# EAGLE design router (EAGLE 8.3.2)
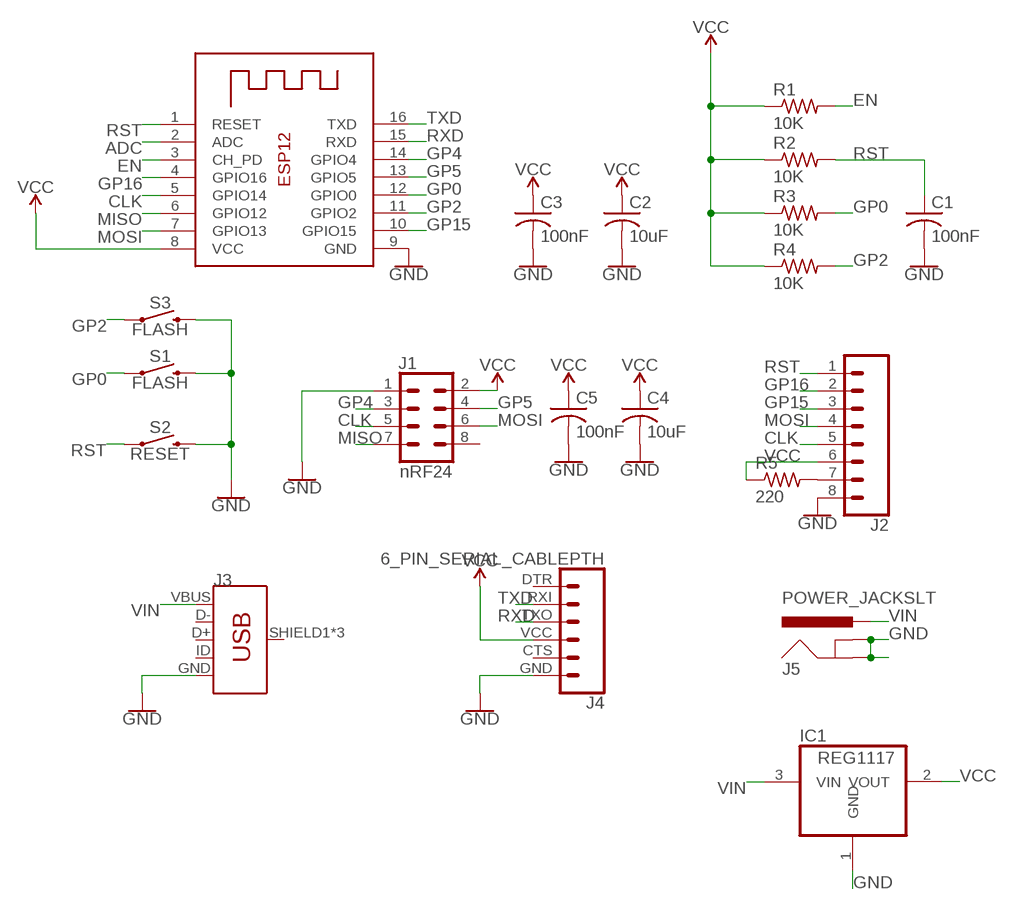
[diagram p0: schematic, sheet 1]

## Parts
C1  100nF  C-USC1206  [C1206]
C2  10uF  C-USC1206  [C1206]
C3  100nF  C-USC1206  [C1206]
C4  10uF  C-USC1206  [C1206]
C5  100nF  C-USC1206  [C1206]
IC1  REG1117  [SOT223]
J1  nRF24  CONN_04X2  [2X4]
J2  CONN_08"  [1X08]
J3  USB_MICRO-B_FEMALE-SMT  [USB-B-MICRO-SMD]
J4  6_PIN_SERIAL_CABLEPTH  [FTDI_BASIC]
J5  POWER_JACKSLT  [POWER_JACK_SLOT]
R1  10K  R-US_M1206  [M1206]
R2  10K  R-US_M1206  [M1206]
R3  10K  R-US_M1206  [M1206]
R4  10K  R-US_M1206  [M1206]
R5  220  R-US_M1206  [M1206]
S1  FLASH  MOMENTARY-SWITCH-SPST-PTH-6.0MM  [TACTILE_SWITCH_PTH_6.0MM]
S2  RESET  MOMENTARY-SWITCH-SPST-PTH-6.0MM  [TACTILE_SWITCH_PTH_6.0MM]
S3  FLASH  MOMENTARY-SWITCH-SPST-PTH-6.0MM  [TACTILE_SWITCH_PTH_6.0MM]
X1  ESP-12  [ESP-12]

## Nets
ADC: X1.2(ADC)
CLK: J1.5 J2.5 X1.5(GPIO14)
EN: R1.2 X1.3(CH_PD)
GND: C1.2 C2.2 C3.2 C4.2 C5.2 IC1.1(GND) J1.1 J2.8 J3.GND J4.GND J5.GND@1(GNDBREAK) J5.GND@2(GND) S1.3 S2.3 S3.3 X1.9(GND)
GP0: R3.2 S1.1 X1.12(GPIO0)
GP2: R4.2 S3.1 X1.11(GPIO2)
GP4: J1.3 X1.14(GPIO4)
GP5: J1.4 X1.13(GPIO5)
GP15: J2.3 X1.10(GPIO15)
GP16: J2.2 X1.4(GPIO16)
MISO: J1.7 X1.6(GPIO12)
MOSI: J1.6 J2.4 X1.7(GPIO13)
N$1: R5.1
N$14: J2.7 R5.2
RST: C1.1 J2.1 R2.2 S2.1 X1.1(RESET)
RXD: J4.TXO X1.15(RXD)
TXD: J4.RXI X1.16(TXD)
VCC: C2.1 C3.1 C4.1 C5.1 IC1.2(VOUT) J1.2 J2.6 J4.VCC R1.1 R2.1 R3.1 R4.1 X1.8(VCC)
VIN: IC1.3(VIN) J3.VBUS J5.PWR
Unconnected: J1.8 J3.D+ J3.D- J3.ID J3.SHIELD1(SHIELD) J3.SHIELD2(SHIELD) J3.SHIELD3(SHIELD) J4.CTS J4.DTR

## Library data of the parts
C1-C5 = adafruit:C-US: CAPACITOR, American symbol
IC1 = burr-brown:REG1117: 800mA and 1A Low Dropout (LDO) Positive Regulator 1.8V, 2.5V, 2.85V, 3.3V, 5V, and Adj; MPN: REG1117; OC_FARNELL: 1097566; OC_NEWARK: 14P6981
J1 = SparkFun-Connectors:CONN_04X2: Multi connection point. Often used as Generic Header-pin footprint for 0.1 inch spaced/style header connections On any of the 0.1 inch spaced packages, you can populate with these: Break Away Headers - Straight <https://www.sparkfun.com/products/116> (PRT-00116) Break Away Male Headers - Right Angle <https://www.sparkfun.com/products/553> (PRT-00553) Female Headers <https://www.sparkfun.com/products/115> (PRT-00115) Break Away Headers - Machine Pin <https://www.sparkfun.com/products/117> (PRT-00117) Break Away Female Headers - Swiss Machine Pin <https://www.sparkfun.com/products/743> (PRT-00743)
J2 = SparkFun-Connectors:CONN_08: Multi connection point. Often used as Generic Header-pin footprint for 0.1 inch spaced/style header connections On any of the 0.1 inch spaced packages, you can populate with these: Break Away Headers - Straight <https://www.sparkfun.com/products/116> (PRT-00116) Break Away Male Headers - Right Angle <https://www.sparkfun.com/products/553> (PRT-00553) Female Headers <https://www.sparkfun.com/products/115> (PRT-00115) Break Away Headers - Machine Pin <https://www.sparkfun.com/products/117> (PRT-00117) Break Away Female Headers - Swiss Machine Pin <https://www.sparkfun.com/products/743> (PRT-00743) Arduino Stackable Header - 8 Pin <https://www.sparkfun.com/products/9279> (PRT-09279) For SCREWTERMINALS and SPRING TERMINALS visit here: Screw Terimnals on SparkFun.com <https://www.sparkfun.com/search/results?term=Screw+Terminals> (5mm/3.5mm/2.54mm spacing) This device is also useful as a general connection point to wire up your design to another part of your project. Our various solder wires solder well into these plated through hole pads. Hook-Up Wire - Assortment (Stranded, 22 AWG) <https://www.sparkfun.com/products/11375> (PRT-11375) Hook-Up Wire - Assortment (Solid Core, 22 AWG) <https://www.sparkfun.com/products/11367> (PRT-11367) View the entire wire category on our website here <https://www.sparkfun.com/categories/141> Special notes: Molex polarized connector foot print use with SKU : PRT-08231 with associated crimp pins and housings. 1MM SMD Version SKU: PRT-10208 NOTES ON THE VARIANTS LOCK and LOCK_LONGPADS... This footprint was designed to help hold the alignment of a through-hole component (i.e. 6-pin header) while soldering it into place. You may notice that each hole has been shifted either up or down by 0.005 of an inch from it's more standard position (which is a perfectly straight line). This slight alteration caused the pins (the squares in the middle) to touch the edges of the holes. Because they are alternating, it causes a "brace" to hold the component in place. 0.005 has proven to be the perfect amount of "off-center" position when using our standard breakaway headers. Although looks a little odd when you look at the bare footprint, once you have a header in there, the alteration is very hard to notice. Also,if you push a header all the way into place, it is covered up entirely on the bottom side.; PROD_ID: CONN-08438
J3 = SparkFun-Connectors:USB_MICRO-B: USB Type Micro-B Connector Male/female and PTH/SMT variants SparkFun Products: SparkFun microB USB Breakout <https://www.sparkfun.com/products/12035> SparkFun USB microB Plug Breakout <https://www.sparkfun.com/products/10031> SparkFun ESP8266 Thing <https://www.sparkfun.com/products/13231>; PROD_ID: CONN-11752
J4 = SparkFun-Connectors:6_PIN_SERIAL_CABLE: 6-pin header connection for use with the "FTDI BASIC" pinout - CABLE SIDE. Also known as "Arduino Serial Program Header". This is used on a design to provide a 6-pin connection point for serial communication usually from a USB cable (D+/D-) to these headers (RX/TX). It also has the remaining pins necessary for programming in the Arduino evironment (DTR, GND, and sometimes VCC). Note, this device has "CABLE" in the name. It is intended to be used on a design that usually lives on the end of your USB cable and prvides the converter chip (FTDI232 or FTDI231x) to commnicate serial RX/TX. The "sister" device, named "TARGET" is inteneded to be used on a design that contains a target micro-controller that you wish to program. You can populate with some of these: Female Headers <https://www.sparkfun.com/products/115> (PRT-00115) For reference (or to suit your programming needs) check out these designs: SparkFun FTDI Basic Breakout - 5V <https://www.sparkfun.com/products/9716> (DEV-09716) SparkFun FTDI Basic Breakout - 3.3V <https://www.sparkfun.com/products/9873> (DEV-09873) SparkFun FTDI SmartBasic <https://www.sparkfun.com/products/12935> (DEV-12935) SparkFun Beefy 3 - FTDI Basic Breakout <https://www.sparkfun.com/products/13746> (DEV-13746)
J5 = SparkFun-Connectors:POWER_JACK: Power Jack Connector This is the standard 5.5mm barrel jack for power. The PTH is the most common, proven, reliable, footprint. The Slot footprint only works if the mill layer is transmitted to the PCB fab house so be warned. Here are the connectors we sell at SparkFun: DC Barrel Power Jack/Connector <https://www.sparkfun.com/products/119> (PRT-00119) DC Barrel Power Jack/Connector (SMD) <https://www.sparkfun.com/products/12748> (PRT-12748) DC Barrel Jack Adapter - Breadboard Compatible <https://www.sparkfun.com/products/10811> (PRT-10811) It is used on this SparkFun product (and many, many others): SparkFun RedBoard - Programmed with Arduino <https://www.sparkfun.com/products/12757> (DEV-12757) Also, if you need a mating power supply or connector, please check these out: Wall Adapter Power Supply - 9VDC 650mA <https://www.sparkfun.com/products/298> (TOL-00298) DC Barrel Jack Adapter - Male <https://www.sparkfun.com/products/10287> (PRT-10287); PROD_ID: PRT-00119
R1-R5 = resistor:R-US_: RESISTOR, American symbol
S1-S3 = SparkFun-Switches:MOMENTARY-SWITCH-SPST: Momentary Switch (Pushbutton) - SPST Normally-open (NO) SPST momentary switches (buttons, pushbuttons). Variants PTH-12MM - 12mm square, through-hole Momentary Pushbutton Switch - 12mm Square <https://www.sparkfun.com/products/9190> (COM-09190) PTH-6.0MM, PTH-6.0MM-KIT - 6.0mm square, through-hole Mini Pushbutton Switch <https://www.sparkfun.com/products/97> (COM-00097) KIT package intended for soldering kit's - only one side of pads' copper is exposed. PTH-RIGHT-ANGLE-KIT - Right-angle, through-hole Right Angle Tactile Button <https://www.sparkfun.com/products/10791> - Used on SparkFun BigTime Watch Kit <https://www.sparkfun.com/products/11734> SMD-12MM - 12mm square, surface-mount Tactile Button - SMD (12mm) <https://www.sparkfun.com/products/12993> (COM-12993) Used on SparkFun PicoBoard <https://www.sparkfun.com/products/11888> SMD-4.5MM - 4.5mm Square Trackball Switch Used on SparkFun Blackberry Trackballer Breakout <https://www.sparkfun.com/products/13169> SMD-4.6MMX2.8MM - 4.60mm x 2.80mm, surface mount Used on SparkFun SAMD21 Mini Breakout <https://www.sparkfun.com/products/13664> SMD-5.2MM, SMD-5.2-REDUNDANT - 5.2mm square, surface-mount Mini Pushbutton Switch - SMD <https://www.sparkfun.com/products/8720> (COM-08720) Used on Arduino Pro Mini <https://www.sparkfun.com/products/11114> REDUNDANT package connects both switch circuits together SMD-6.0X3.5MM - 6.0 x 3.5mm, surface mount Momentary Reset Switch SMD <https://www.sparkfun.com/products/8229> (COM-08229) SMD-6.2MM-TALL - 6.2mm square, surface mount Tactile Button - SMD (6mm) <https://www.sparkfun.com/products/12992> Used on SparkFun Digital Sandbox <https://www.sparkfun.com/products/12651> SMD-RIGHT-ANGLE - Right-angle, surface mount Used on SparkFun Block for Intel® Edison - Arduino <https://www.sparkfun.com/products/13036>; PROD_ID: SWCH-08441; SF_SKU: COM-00097
X1 = adafruit:ESP-12

## Board
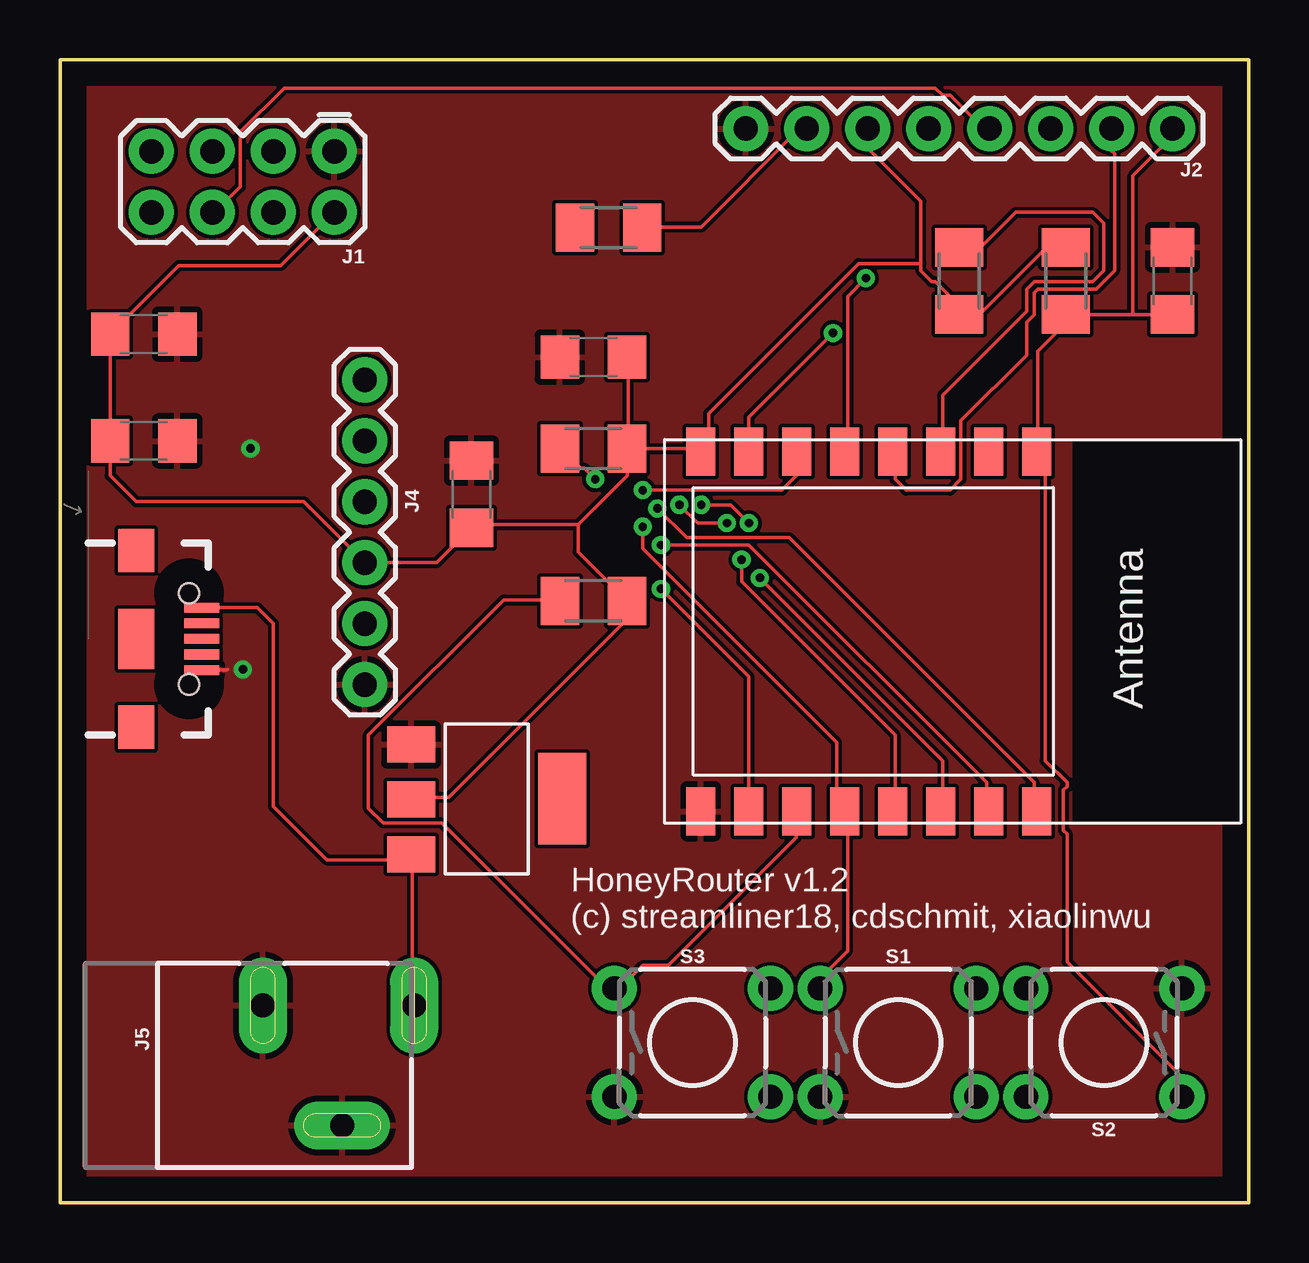
[diagram p1: board, top side]
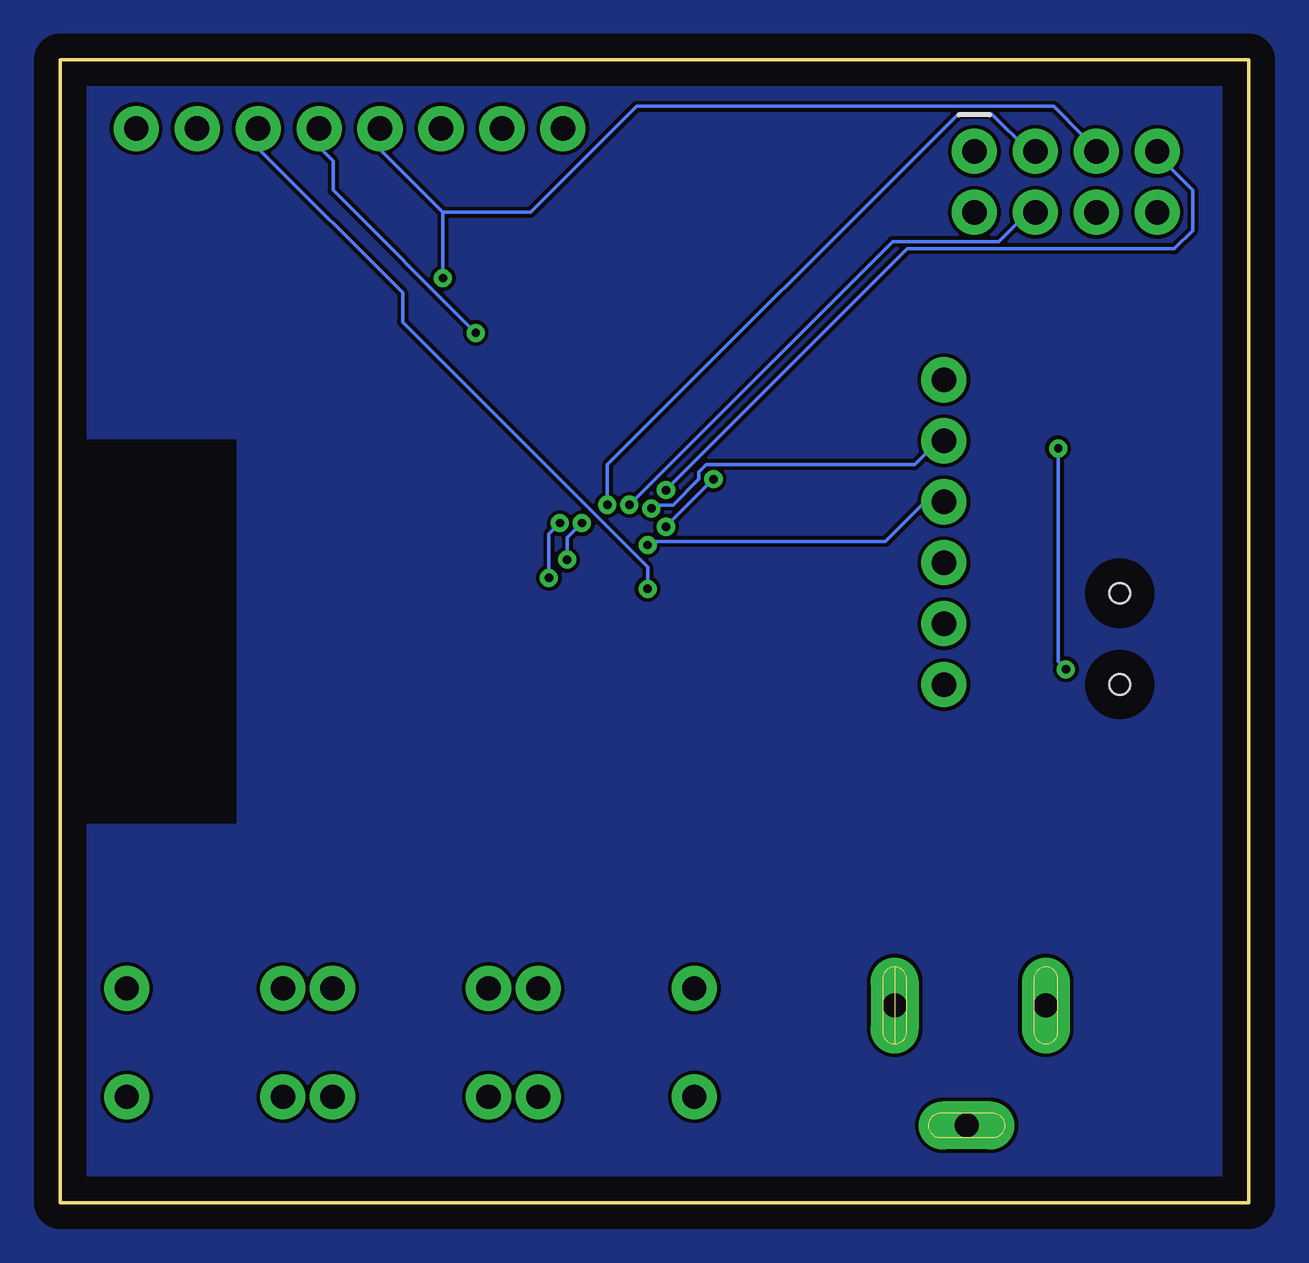
[diagram p2: board, bottom side, seen from below]

Size 49.53 x 47.62 mm. Coordinates in mm from the lower left corner, seen from the top.
Outline: 0,47.62 0,0 49.53,0 49.53,47.62 0,47.62
Copper layers (1*16): Top 0.035mm / dielectric 1.5mm / Bottom 0.035mm
Design rules "default": minimum track width 6mil, minimum drill 0.35mm, track to track 6mil, track to pad 6mil, pad to pad 6mil, via to via 6mil, smd to smd 6mil, copper to edge 40mil, drill to drill 6mil, minimum pad ring 10mil, minimum via ring 8mil, stop-mask expansion 4mil, vias tented up to drill 0mil, thermal gap 10mil

### Footprints (pad centres in the part's own frame; a part is rotated, then mirrored left to right if it is on the bottom)
C1206 = smd 1.6 x 1.8: 1 -1.4,0; 2 1.4,0
SOT223 = smd 1.499 x 2.007: 1 -2.261,-3.15; 2 0.025,-3.15; 3 2.311,-3.15 | smd 3.81 x 2.007: 4 0,3.15
2X4 = drill 1.016 pad 1.88: 1 -3.81,-1.27; 2 -3.81,1.27; 3 -1.27,-1.27; 4 -1.27,1.27; 5 1.27,-1.27; 6 1.27,1.27; 7 3.81,-1.27; 8 3.81,1.27
1X08 = drill 1.016 pad 1.88: 1 0,0; 2 2.54,0; 3 5.08,0; 4 7.62,0; 5 10.16,0; 6 12.7,0; 7 15.24,0; 8 17.78,0
USB-B-MICRO-SMD = smd 1.45 x 0.4: D+ 2.725,0; D- 2.725,0.65; GND 2.725,-1.3; ID 2.725,-0.65; VBUS 2.725,1.3 | smd 1.5 x 1.8: SHIELD1 0,3.685; SHIELD2 0,-3.685 | smd 1.5 x 2.5: SHIELD3 0,0 | hole 0.85: 2.2,1.9; 2.2,-1.9
FTDI_BASIC = drill 1.016 pad 1.88: CTS 10.16,0; DTR 0,0; GND 12.7,0; RXI 2.54,0; TXO 5.08,0; VCC 7.62,0
POWER_JACK_SLOT = drill 1 pad 2 long: GND@1 2.58,7.5; GND@2 7.58,10.8; PWR 2.58,13.8
M1206 = smd 1.6 x 2: 1 -1.4,0; 2 1.4,0
TACTILE_SWITCH_PTH_6.0MM = drill 1.016 pad 1.88: 1 -3.251,2.261; 2 3.251,2.261; 3 -3.251,-2.261; 4 3.251,-2.261
ESP-12 = smd 2 x 1.2: 1 -7.5,4.5; 2 -7.5,2.5; 3 -7.5,0.5; 4 -7.5,-1.5; 5 -7.5,-3.5; 6 -7.5,-5.5; 7 -7.5,-7.5; 8 -7.5,-9.5; 9 7.5,-9.5; 10 7.5,-7.5; 11 7.5,-5.5; 12 7.5,-3.5; 13 7.5,-1.5; 14 7.5,0.5; 15 7.5,2.5; 16 7.5,4.5

### Placement (x,y rotation side)
C1  46.36,38.42 90 top
C2  22.23,35.24 180 top
C3  17.15,29.53 90 top
C4  3.49,31.75 0 top
C5  3.49,36.2 0 top
IC1  17.78,16.83 270 top
J1  7.62,42.55 180 top
J2  46.36,44.77 180 top
J3  3.18,23.5 0 top
J4  12.7,34.29 270 top
J5  0.95,10.8 270 top
R1  37.47,38.42 90 top
R2  41.91,38.42 270 top
R3  22.23,31.43 180 top
R4  22.23,25.08 180 top
R5  22.86,40.64 0 top
S1  34.92,6.67 0 top
S2  43.5,6.67 180 top
S3  26.35,6.67 0 top
X1  36.2,23.81 270 top

### Tracks (layer width: path | path; a pad name or v marks a point on that pad's centre or on a via)
CLK  (via drill 0.35)
  Top 0.152: v33.58,38.53 32.82,37.77 32.82,31.37 X1.5
  Bottom 0.152: 33.58,41.27 v33.58,38.53 | 33.58,41.27 36.17,43.87 36.17,44.63 J2.5 | 33.58,41.27 29.92,41.27 25.5,45.7 8.13,45.7 6.91,44.48 6.91,44.32 6.45,43.87 J1.5
EN
  Top 0.152: X1.3 36.78,31.37 36.78,33.66 40.28,37.16 40.28,38.08 40.59,38.38 43.03,38.38 43.48,38.84 43.48,40.82 43.03,41.27 39.83,41.27 38.46,39.9 37.54,39.9 R1.2
GND  (via drill 0.35)
  Top 0.152: J3.GND 6.96,22.2 6.99,22.23
  Bottom 0.152: v7.94,31.43 7.94,22.54 v7.62,22.23
  pour Top: -2.54,50.17 -2.54,-6.98 53.34,-6.98 53.34,50.17
GP0  (via drill 0.35)
  Top 0.152: S1.1 31.75,8.97 31.75,9.42 32.82,10.49 32.82,16.28 X1.12 32.66,16.43 32.36,16.74 32.36,19.18 24.28,27.25 v24.28,28.17 | v22.3,30.15 21.84,30.61 21.69,30.61 20.93,31.37 R3.2
  Bottom 0.152: v24.28,28.17 v22.3,30.15
GP2
  Top 0.152: X1.11 30.68,16.28 30.68,15.21 25.35,9.88 24.28,9.88 23.22,8.81 S3.1 23.06,8.97 22.76,8.97 15.9,15.82 13.46,15.82 12.85,16.43 12.85,19.48 18.49,25.12 20.78,25.12 R4.2
GP4  (via drill 0.35)
  Top 0.152: v29.16,26.04 36.78,18.41 36.78,16.43 X1.14 | v28.7,28.32 27.94,29.08 v26.72,29.08
  Bottom 0.152: v29.16,26.04 29.16,27.86 v28.7,28.32 | v26.72,29.08 26.72,30.76 12.09,45.39 10.72,45.39 9.2,43.87 8.89,43.87 J1.3
GP5  (via drill 0.35)
  Top 0.152: v28.4,26.8 28.4,25.88 34.8,19.48 34.8,16.43 X1.13 | v27.79,28.32 26.57,28.32 v25.81,29.08
  Bottom 0.152: v28.4,26.8 28.4,27.71 v27.79,28.32 | v25.81,29.08 14.83,40.06 10.41,40.06 9.2,41.27 J1.4
GP15  (via drill 0.35)
  Top 0.152: v25.04,25.58 28.7,21.92 28.7,16.43 X1.10
  Bottom 0.152: v25.04,25.58 25.04,26.49 35.26,36.7 35.26,37.92 41.2,43.87 41.2,44.63 J2.3
GP16
  Top 0.152: X1.4 34.8,31.22 34.8,30.15 35.26,29.69 37.08,29.69 37.54,30.15 37.54,32.59 40.28,35.33 40.28,36.7 40.59,37.01 40.59,37.92 40.74,38.08 43.18,38.08 43.94,38.84 43.94,43.71 43.79,43.87 43.79,44.63 J2.2
MISO  (via drill 0.35)
  Top 0.152: v24.28,29.69 30.07,29.69 30.68,30.3 30.68,31.22 X1.6
  Bottom 0.152: v24.28,29.69 14.22,39.75 3.1,39.75 2.34,40.51 2.34,42.19 3.86,43.71 J1.7
MOSI  (via drill 0.35)
  Top 0.152: v32.21,36.25 28.7,32.74 28.7,31.37 X1.7 | J1.6 6.45,41.27 7.52,42.34 7.52,44.63 9.35,46.46 36.47,46.46 36.78,46.15 37.08,46.15 38.61,44.63 J2.4
  Bottom 0.152: v32.21,36.25 38.15,42.19 38.15,43.41 38.61,43.87 38.61,44.63 J2.4
N$14
  Top 0.152: R5.2 24.28,40.66 26.72,40.66 30.68,44.63 30.99,44.63 J2.7
NAME
  pour Bottom: -8.89,52.07 -8.89,-4.45 -8.25,-5.08 53.02,-5.08 53.66,-4.45 53.66,53.34 -7.62,53.34
RST
  Top 0.152: 44.7,37.01 41.96,37.01 R2.2 41.81,37.01 41.81,36.55 40.74,35.48 40.74,31.37 X1.1 40.74,31.22 41.05,30.91 41.05,18.41 41.96,17.5 41.96,17.35 41.81,17.2 41.81,15.52 41.96,15.37 41.96,10.03 46.69,5.31 46.69,4.55 S2.1 | 44.7,37.01 46.23,37.01 C1.1 | 44.7,37.01 44.7,42.8 46.23,44.32 46.23,44.63 J2.1
RXD  (via drill 0.35)
  Top 0.152: v25.04,27.41 28.7,27.41 38.61,17.5 38.61,16.43 X1.15
  Bottom 0.152: v25.04,27.41 24.89,27.56 15.14,27.56 13.61,29.08 12.7,29.08 J4.TXO
TXD  (via drill 0.35)
  Top 0.152: v24.89,28.93 26.11,27.71 30.38,27.71 40.59,17.5 40.59,16.43 X1.16
  Bottom 0.152: v24.89,28.93 24.74,29.08 23.98,29.08 22.91,30.15 22.91,30.46 22.61,30.76 13.92,30.76 13.01,31.67 12.7,31.67 J4.RXI
VCC
  Top 0.152: 37.69,37.16 38.46,37.16 41.05,39.75 41.81,39.75 R2.1 | 37.69,37.16 37.54,37.16 R1.1 37.69,37.16 | 35.87,39.14 35.87,38.84 36.32,38.38 36.47,38.38 37.69,37.16 | 35.87,39.14 35.87,41.73 33.73,43.87 33.73,44.63 J2.6 | C2.1 23.67,35.18 23.67,31.52 R3.1 | IC1.2 14.68,16.89 16.21,16.89 23.52,24.21 23.52,24.97 R4.1 21.59,27.12 21.59,28.26 | 35.87,39.14 33.27,39.14 27.03,32.89 27.03,31.67 26.72,31.37 X1.8 26.58,31.43 R3.1 | R3.1 23.62,30.29 21.59,28.26 | 21.59,28.26 17.28,28.26 C3.1 15.69,26.67 J4.VCC 10.16,29.21 3.18,29.21 2.09,30.29 C4.1 C5.1 4.95,39.05 9.21,39.05 J1.2
VIN
  Top 0.152: 14.68,14.45 14.68,10.49 J5.PWR | 14.68,14.45 IC1.3 | J3.VBUS 8.23,24.8 8.89,24.13 8.89,16.51 11.11,14.29 14.52,14.29 14.68,14.45

### Text on the board
tNames: HoneyRouter v1.2 / (c) streamliner18, cdschmit, xiaolinwu